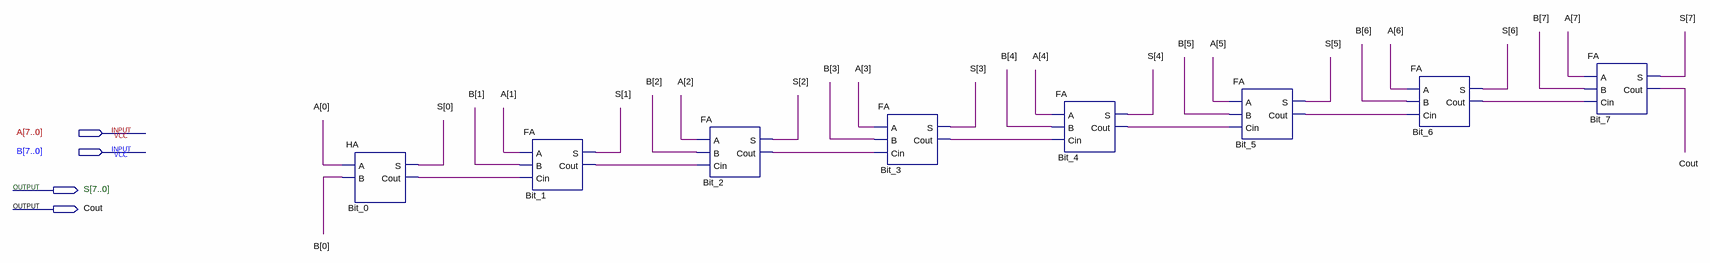
[diagram p0: schematic sheet]
// Quartus schematic RCA.bdf as structural Verilog: 8 symbols, 4 pins
module RCA (
  input  [7:0] A,
  input  [7:0] B,
  output [7:0] S,
  output Cout
);

  wire Bit_0_cout, Bit_1_cout, Bit_2_cout, Bit_3_cout, Bit_4_cout, Bit_5_cout, Bit_6_cout;

  HA Bit_0 (.A(A[0]), .B(B[0]), .S(S[0]), .Cout(Bit_0_cout));
  FA Bit_1 (.A(A[1]), .B(B[1]), .Cin(Bit_0_cout), .S(S[1]), .Cout(Bit_1_cout));
  FA Bit_2 (.A(A[2]), .B(B[2]), .Cin(Bit_1_cout), .S(S[2]), .Cout(Bit_2_cout));
  FA Bit_3 (.A(A[3]), .B(B[3]), .Cin(Bit_2_cout), .S(S[3]), .Cout(Bit_3_cout));
  FA Bit_4 (.A(A[4]), .B(B[4]), .Cin(Bit_3_cout), .S(S[4]), .Cout(Bit_4_cout));
  FA Bit_5 (.A(A[5]), .B(B[5]), .Cin(Bit_4_cout), .S(S[5]), .Cout(Bit_5_cout));
  FA Bit_6 (.A(A[6]), .B(B[6]), .Cin(Bit_5_cout), .S(S[6]), .Cout(Bit_6_cout));
  FA Bit_7 (.A(A[7]), .B(B[7]), .Cin(Bit_6_cout), .S(S[7]), .Cout(Cout));
endmodule
